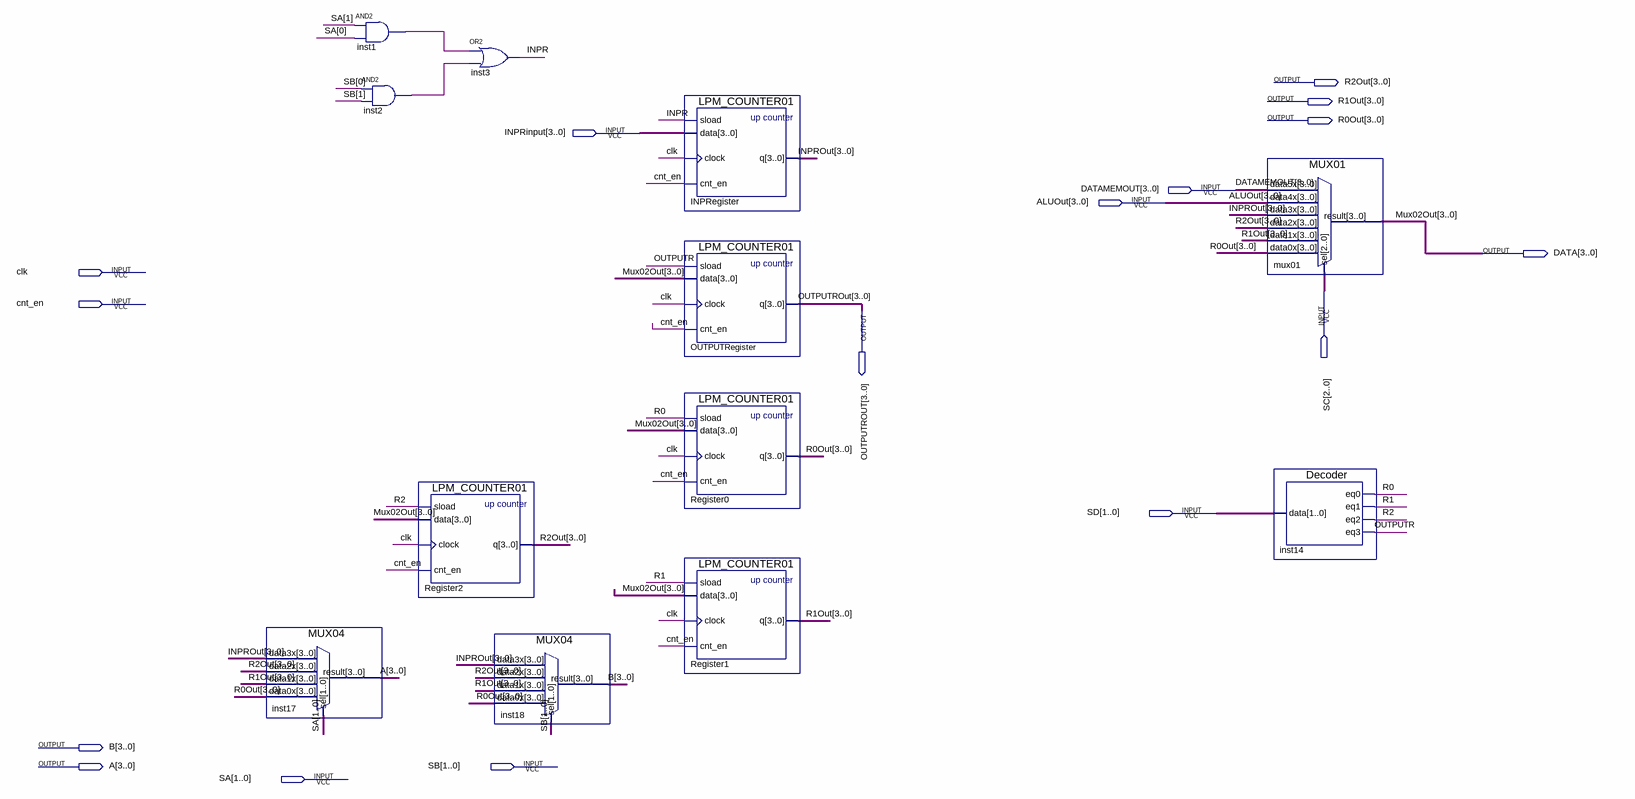
[diagram p0: schematic sheet]
// Quartus schematic Yedek_BUS_Nilay_Yucel_2017510082.bdf as structural Verilog: 12 symbols, 16 pins
module Yedek_BUS_Nilay_Yucel_2017510082 (
  input  [3:0] INPRinput,
  input  [3:0] DATAMEMOUT,
  input  [3:0] ALUOut,
  input  clk,
  input  [2:0] SC,
  input  cnt_en,
  input  [1:0] SD,
  input  [1:0] SB,
  input  [1:0] SA,
  output [3:0] R2Out,
  output [3:0] R1Out,
  output [3:0] R0Out,
  output [3:0] DATA,
  output [3:0] OUTPUTROUT,
  output [3:0] B,
  output [3:0] A
);

  wire INPR, inst1_out, inst2_out, OUTPUTR, R0, R1, R2;
  wire [3:0] INPROut;

  MUX04 inst17 (.data3x(INPROut), .data2x(R2Out), .data1x(R1Out), .data0x(R0Out), .sel(SA), .result(A));
  and inst1 (inst1_out, SA[1], SA[0]);
  and inst2 (inst2_out, SB[0], SB[1]);
  LPM_COUNTER01 Register2 (.sload(R2), .data(DATA), .clock(clk), .cnt_en(cnt_en), .q(R2Out));
  or inst3 (INPR, inst1_out, inst2_out);
  MUX04 inst18 (.data3x(INPROut), .data2x(R2Out), .data1x(R1Out), .data0x(R0Out), .sel(SB), .result(B));
  LPM_COUNTER01 INPRegister (.sload(INPR), .data(INPRinput), .clock(clk), .cnt_en(cnt_en), .q(INPROut));
  LPM_COUNTER01 OUTPUTRegister (.sload(OUTPUTR), .data(DATA), .clock(clk), .cnt_en(cnt_en), .q(OUTPUTROUT));
  LPM_COUNTER01 Register0 (.sload(R0), .data(DATA), .clock(clk), .cnt_en(cnt_en), .q(R0Out));
  LPM_COUNTER01 Register1 (.sload(R1), .data(DATA), .clock(clk), .cnt_en(cnt_en), .q(R1Out));
  MUX01 mux01 (
    .data5x(DATAMEMOUT), .data4x(ALUOut), .data3x(INPROut), .data2x(R2Out), .data1x(R1Out), .data0x(R0Out),
    .sel(SC), .result(DATA));
  Decoder inst14 (.data(SD), .eq0(R0), .eq1(R1), .eq2(R2), .eq3(OUTPUTR));

  // Other names for the same wires on the sheet: Mux02Out[3:0] = DATA
endmodule
